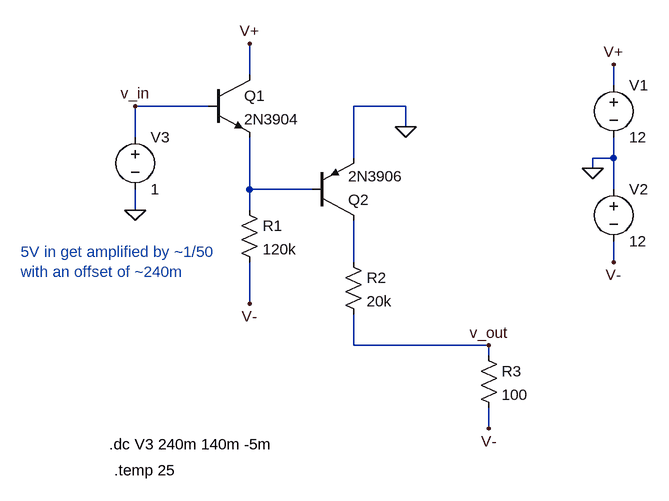
[diagram p0: schematic 2023-04-01 MFOS VCA log stage.asc]
2023-04-01 MFOS VCA log stage.asc, the LTspice schematic file:
Version 4
SHEET 1 880 736
WIRE -160 112 -160 64
WIRE 400 128 400 96
WIRE -224 160 -336 160
WIRE 80 160 0 160
WIRE 80 192 80 160
WIRE -336 208 -336 160
WIRE 0 240 0 160
WIRE 400 240 400 208
WIRE 400 240 368 240
WIRE 368 256 368 240
WIRE -160 288 -160 208
WIRE -64 288 -160 288
WIRE 400 288 400 240
WIRE -336 320 -336 288
WIRE -160 320 -160 288
WIRE 0 400 0 336
WIRE 400 400 400 368
WIRE -160 464 -160 400
WIRE 0 528 0 480
WIRE 208 528 0 528
WIRE 208 544 208 528
WIRE 208 656 208 624
FLAG -160 464 V-
FLAG -160 64 V+
FLAG 80 192 0
FLAG 400 96 V+
FLAG 400 400 V-
FLAG 368 256 0
FLAG -336 320 0
FLAG 208 528 v_out
FLAG -336 160 v_in
FLAG 208 656 V-
SYMBOL npn -224 112 R0
SYMATTR InstName Q1
SYMATTR Value 2N3904
SYMBOL pnp -64 336 M180
SYMATTR InstName Q2
SYMATTR Value 2N3906
SYMBOL res -176 304 R0
SYMATTR InstName R1
SYMATTR Value 120k
SYMBOL res -16 384 R0
SYMATTR InstName R2
SYMATTR Value 20k
SYMBOL voltage 400 112 R0
WINDOW 123 0 0 Left 0
WINDOW 39 24 44 Left 2
SYMATTR InstName V1
SYMATTR Value 12
SYMBOL voltage 400 272 R0
WINDOW 123 0 0 Left 0
WINDOW 39 0 0 Left 0
SYMATTR InstName V2
SYMATTR Value 12
SYMBOL voltage -336 192 R0
WINDOW 123 0 0 Left 0
WINDOW 39 0 0 Left 0
SYMATTR InstName V3
SYMATTR Value 1
SYMBOL res 192 528 R0
SYMATTR InstName R3
SYMATTR Value 100
TEXT -376 680 Left 2 !.dc V3 240m 140m -5m
TEXT -512 384 Left 2 ;5V in get amplified by ~1/50\nwith an offset of ~240m
TEXT -368 720 Left 2 !.temp 25

The netlist it stands for:
* 2023-04-01 MFOS VCA log stage.asc
Q1 V+ v_in N001 0 2N3904
Q2 N002 N001 0 0 2N3906
R1 N001 V- 120k
R2 N002 v_out 20k
V1 V+ 0 12
V2 0 V- 12
V3 v_in 0 1
R3 v_out V- 100
.model NPN NPN
.model PNP PNP
.lib standard.bjt
.dc V3 240m 140m -5m
* 5V in get amplified by ~1/50
* with an offset of ~240m
.temp 25
.backanno
.end